# Altium schematic sheet vehicle_control.SchDoc
size A
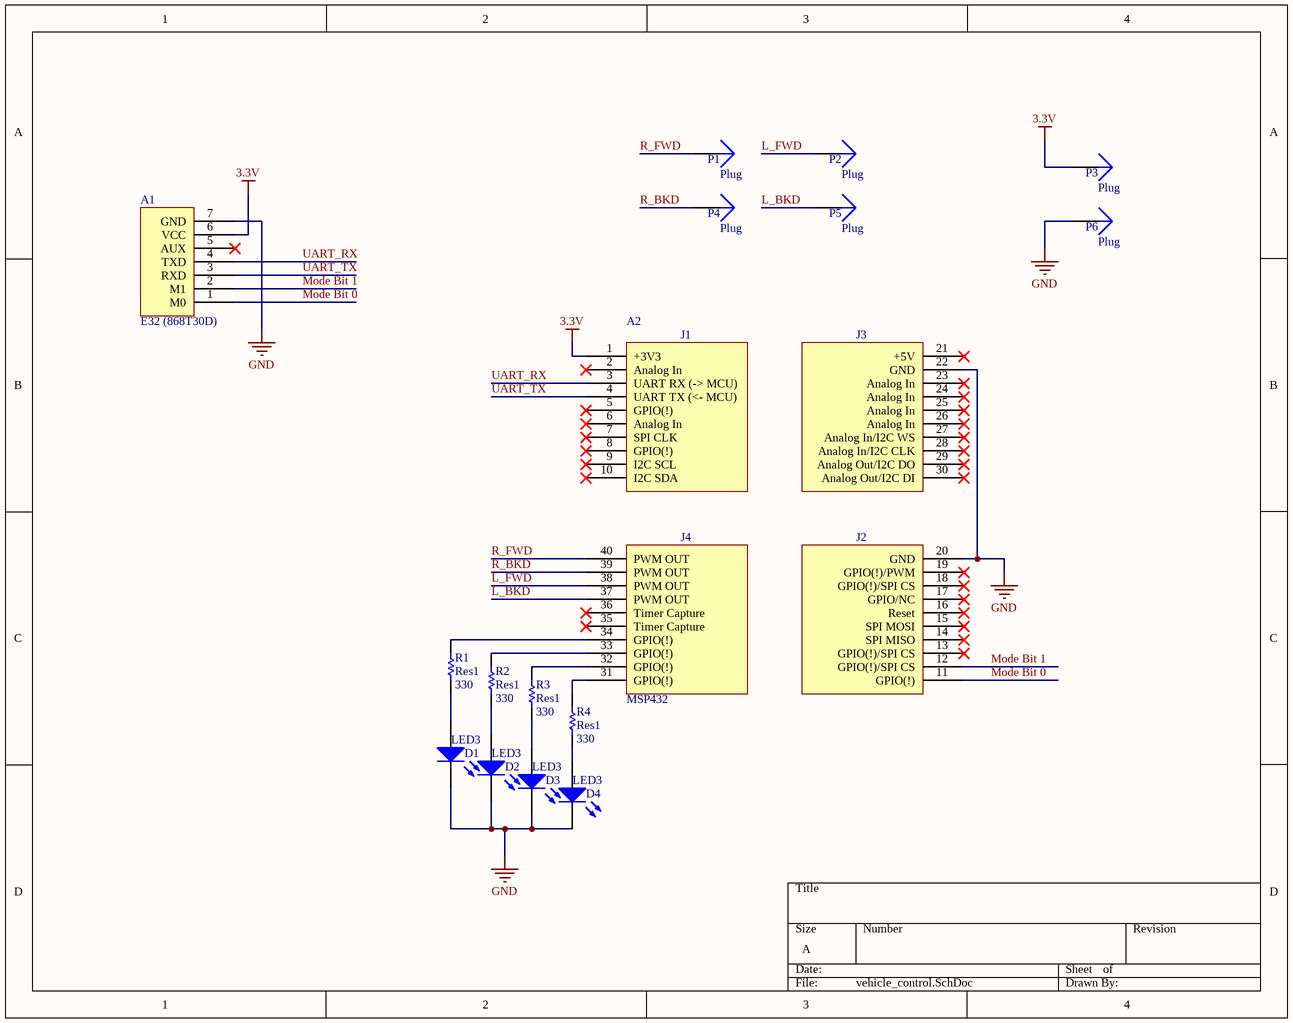
[diagram p0: vehicle_control.SchDoc]

## Parts
A1  E32 (868T30D)  [HDR1X7]
A2  MSP432  [MSP432]
D1  LED3  [Diode]
D2  LED3  [Diode]
D3  LED3  [Diode]
D4  LED3  [Diode]
P1  Plug  [STANDOFF]
P2  Plug  [STANDOFF]
P3  Plug  [STANDOFF]
P4  Plug  [STANDOFF]
P5  Plug  [STANDOFF]
P6  Plug  [STANDOFF]
R1  Res1  value 330  [AXIAL-0.3]
R2  Res1  value 330  [AXIAL-0.3]
R3  Res1  value 330  [AXIAL-0.3]
R4  Res1  value 330  [AXIAL-0.3]

## Nets
3.3V: A1.6(VCC) A2.1(+3V3) P3.1
GND: A1.7(GND) A2.20(GND) A2.22(GND) D1.2(K) D2.2(K) D3.2(K) D4.2(K) P6.1
L_BKD: A2.37(PWM_OUT) P5.1
L_FWD: A2.38(PWM_OUT) P2.1
Mode Bit 0: A1.1(M0) A2.11(GPIO(!))
Mode Bit 1: A1.2(M1) A2.12(GPIO(!)/SPI_CS)
R_BKD: A2.39(PWM_OUT) P4.1
R_FWD: A2.40(PWM_OUT) P1.1
UART_RX: A1.4(TXD) A2.3(UART_RX_(->_MCU))
UART_TX: A1.3(RXD) A2.4(UART_TX_(<-_MCU))
NetA2_31: A2.31(GPIO(!)) R4.1
NetA2_32: A2.32(GPIO(!)) R3.1
NetA2_33: A2.33(GPIO(!)) R2.1
NetA2_34: A2.34(GPIO(!)) R1.1
NetD1_1: D1.1(A) R1.2
NetD2_1: D2.1(A) R2.2
NetD3_1: D3.1(A) R3.2
NetD4_1: D4.1(A) R4.2

Not connected (* = marked no-connect by the designer): A1 5(AUX)*; A2 2(Analog_In)* 5(GPIO(!))* 6(Analog_In)* 7(SPI_CLK)* 8(GPIO(!))* 9(I2C_SCL)* 10(I2C_SDA)* 13(GPIO(!)/SPI_CS)* 14(SPI_MISO)* 15(SPI_MOSI)* 16(Reset)* 17(GPIO/NC)* 18(GPIO(!)/SPI_CS)* 19(GPIO(!)/PWM)* 21(+5V)* 23(Analog_In)* 24(Analog_In)* 25(Analog_In)* 26(Analog_In)* 27(Analog_In/I2C_WS)* 28(Analog_In/I2C_CLK)* 29(Analog_Out/I2C_DO)* 30(Analog_Out/I2C_DI)* 35(Timer_Capture)* 36(Timer_Capture)*

## Notes on the sheet
- (in symbol MSP432) J1; J3; J4; J2

## Library data of the parts
A1 = SX1276 E32
A2 = MSP432: MSP432 Dev Kit Launchpad
D1-D4 = LED3: Typical BLUE SiC LED; Published: 8-Jun-2000; LatestRevisionDate: 17-Dec-2003; LatestRevisionNote: PCB Footprint replaced.; DatasheetVersion: 16-Apr-2002; PackageVersion: 16-Apr-2002; PackageReference: 3.5X2.8X1.9; Publisher: Altium Limited; PackageDescription: SM LED; 2 C-Bend Leads; Body 3.5 x 2.8 x 1.9 mm, inc leads (LxWxH typ)
R1-R4 = Res1: Resistor; Published: 8-Jun-2000; LatestRevisionDate: 17-Jul-2002; LatestRevisionNote: Re-released for DXP Platform.; PackageReference: AXIAL-0.3; Publisher: Altium Limited; PackageDescription: Axial Device, Thru-Hole; 2 Leads; 0.3 in Pin Spacing
P1-P6 = Plug: LatestRevisionDate: 17-Jul-2002; LatestRevisionNote: Re-released for DXP Platform.; Publisher: Altium Limited